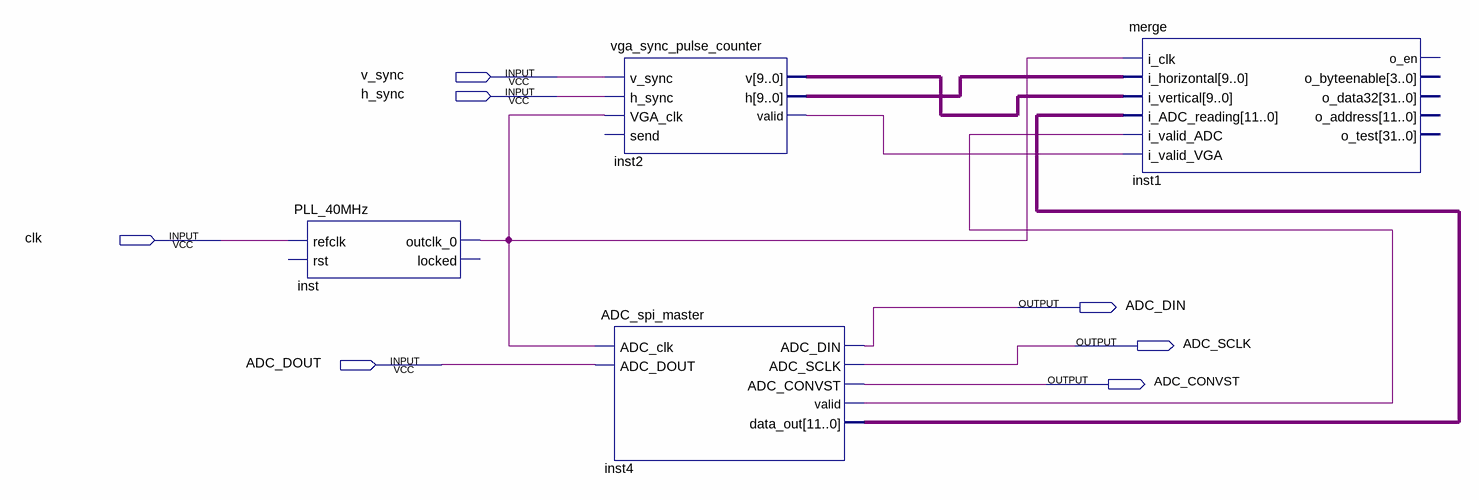
[diagram p0: schematic sheet]
// Quartus schematic main.bdf as structural Verilog: 4 symbols, 7 pins
module main (
  input  v_sync,
  input  h_sync,
  input  clk,
  input  ADC_DOUT,
  output ADC_DIN,
  output ADC_SCLK,
  output ADC_CONVST
);

  wire inst2_valid, inst4_valid, inst_outclk_0;
  wire [9:0] inst2_h, inst2_v;
  wire [11:0] inst4_data_out;

  PLL_40MHz inst (.refclk(clk), .outclk_0(inst_outclk_0));  // open: rst, locked
  vga_sync_pulse_counter inst2 (
    .v_sync(v_sync), .h_sync(h_sync), .VGA_clk(inst_outclk_0), .v(inst2_v), .h(inst2_h), .valid(inst2_valid));  // open: send
  ADC_spi_master inst4 (
    .ADC_clk(inst_outclk_0), .ADC_DOUT(ADC_DOUT), .ADC_DIN(ADC_DIN), .ADC_SCLK(ADC_SCLK),
    .ADC_CONVST(ADC_CONVST), .valid(inst4_valid), .data_out(inst4_data_out));
  merge inst1 (
    .i_clk(inst_outclk_0), .i_horizontal(inst2_h), .i_vertical(inst2_v), .i_ADC_reading(inst4_data_out),
    .i_valid_ADC(inst4_valid), .i_valid_VGA(inst2_valid));  // open: o_en, o_byteenable, o_data32, o_address, o_test
endmodule
